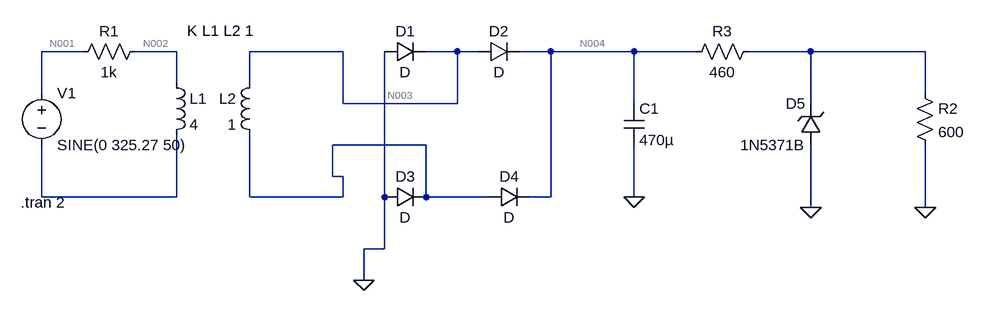
[diagram p0: schematic demo.asc]
demo.asc, the LTspice schematic file:
Version 4.1
SHEET 1 1300 680
WIRE -64 -144 -128 -144
WIRE 80 -144 16 -144
WIRE 336 -144 192 -144
WIRE 512 -144 464 -144
WIRE 544 -144 512 -144
WIRE 656 -144 608 -144
WIRE 784 -144 656 -144
WIRE 880 -144 784 -144
WIRE 1056 -144 960 -144
WIRE 1232 -144 1056 -144
WIRE 80 -96 80 -144
WIRE 192 -96 192 -144
WIRE -128 -80 -128 -144
WIRE 1232 -80 1232 -144
WIRE 336 -64 336 -144
WIRE 512 -64 512 -144
WIRE 512 -64 336 -64
WIRE 784 -64 784 -144
WIRE 1056 -64 1056 -144
WIRE 464 0 320 0
WIRE 320 48 320 0
WIRE 336 48 320 48
WIRE -128 80 -128 0
WIRE 80 80 80 -16
WIRE 80 80 -128 80
WIRE 192 80 192 -16
WIRE 336 80 336 48
WIRE 336 80 192 80
WIRE 400 80 400 -144
WIRE 464 80 464 0
WIRE 560 80 464 80
WIRE 656 80 656 -144
WIRE 656 80 624 80
WIRE 784 80 784 0
WIRE 1056 96 1056 0
WIRE 1232 96 1232 0
WIRE 400 160 400 80
WIRE 400 160 368 160
WIRE 368 208 368 160
FLAG 368 208 0
FLAG 1232 96 0
FLAG 784 80 0
FLAG 1056 96 0
SYMBOL voltage -128 -96 R0
WINDOW 123 0 0 Left 0
WINDOW 39 0 0 Left 0
SYMATTR InstName V1
SYMATTR Value SINE(0 325.27 50)
SYMBOL res 32 -160 R90
WINDOW 0 0 56 VBottom 2
WINDOW 3 32 56 VTop 2
SYMATTR InstName R1
SYMATTR Value 1k
SYMBOL ind 64 -112 R0
SYMATTR InstName L1
SYMATTR Value 4
SYMATTR Type ind
SYMBOL ind 208 -112 M0
SYMATTR InstName L2
SYMATTR Value 1
SYMATTR Type ind
SYMBOL diode 400 -128 R270
WINDOW 0 32 32 VTop 2
WINDOW 3 0 32 VBottom 2
SYMATTR InstName D1
SYMBOL diode 544 -128 R270
WINDOW 0 32 32 VTop 2
WINDOW 3 0 32 VBottom 2
SYMATTR InstName D2
SYMBOL diode 400 96 R270
WINDOW 0 32 32 VTop 2
WINDOW 3 0 32 VBottom 2
SYMATTR InstName D3
SYMBOL diode 560 96 R270
WINDOW 0 32 32 VTop 2
WINDOW 3 0 32 VBottom 2
SYMATTR InstName D4
SYMBOL res 1216 -96 R0
SYMATTR InstName R2
SYMATTR Value 600
SYMBOL cap 768 -64 R0
SYMATTR InstName C1
SYMATTR Value 470µ
SYMBOL res 976 -160 R90
WINDOW 0 0 56 VBottom 2
WINDOW 3 32 56 VTop 2
SYMATTR InstName R3
SYMATTR Value 460
SYMBOL zener 1072 0 R180
WINDOW 0 24 64 Left 2
WINDOW 3 24 0 Left 2
SYMATTR InstName D5
SYMATTR Value 1N5371B
TEXT -160 88 Left 2 !.tran 2
TEXT 96 -176 Left 2 !K L1 L2 1

The netlist it stands for:
* demo.asc
V1 N001 N007 SINE(0 325.27 50)
R1 N002 N001 1k
L1 N002 N007 4
L2 N003 N006 1
D1 0 N003 D
D2 N003 N004 D
D3 0 N006 D
D4 N006 N004 D
R2 N005 0 600
C1 N004 0 470µ
R3 N005 N004 460
D5 0 N005 1N5371B
.model D D
.lib standard.dio
.tran 2
K L1 L2 1
.backanno
.end

* Results of the author's LTspice run, read from the files saved beside the schematic
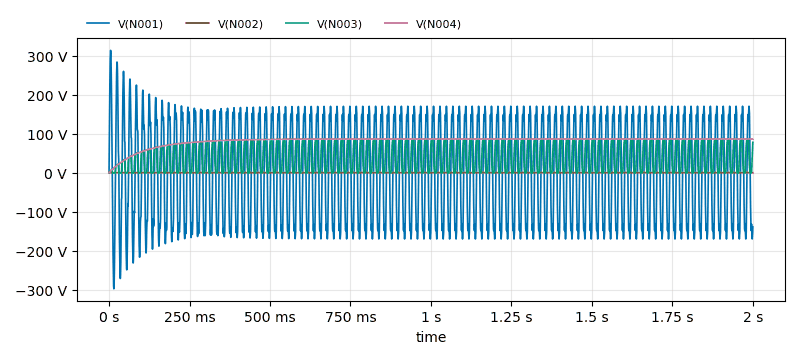
[diagram p1: Transient Analysis of demo.asc, plotted from the saved traces]
* Transient Analysis, 1 run:
*   V(N001): min -298.1 V, max 313.6 V, average 282.3 mV, rms 132.5 V, last -139.2 V
*   V(N002): min -7.538 µV, max 7.164 µV, average -6.786 nV, rms 3.185 µV, last 3.345 µV
*   V(N003): min -820.5 mV, max 87.41 V, average 40.71 V, rms 54.63 V, last 77.77 V
*   V(N004): min 0 V, max 86.64 V, average 81.56 V, rms 82.62 V, last 85.96 V